# EAGLE design openSX70-FPC-breakout (EAGLE 8.5.1)
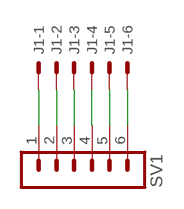
[diagram p0: schematic, sheet 1]

## Parts
J1  XF2L-0625-1  [XF2L-0625-1]
SV1  MA06-1  [MA06-1]

## Nets
GND: J1.1 SV1.1
N$2: J1.2 SV1.2
N$3: J1.3 SV1.3
N$4: J1.4 SV1.4
N$5: J1.5 SV1.5
N$6: J1.6 SV1.6

## Library data of the parts
J1 = con-omron:XF2*-06?: OMRON FPC Connector Source : http://www.omron.com/ecb/products/pdf/fpc.pdf; MF: OMRON COMPONENTS USA; MPN: XF2L-0625-1; OC_FARNELL: 1536105; OC_NEWARK: 29C7842
SV1 = con-lstb:MA06-1: PIN HEADER; OC_FARNELL: unknown; OC_NEWARK: unknown

## Net classes
0 default: width 0.152 mm, drill 0.33 mm, clearance 0.152 mm

## Board
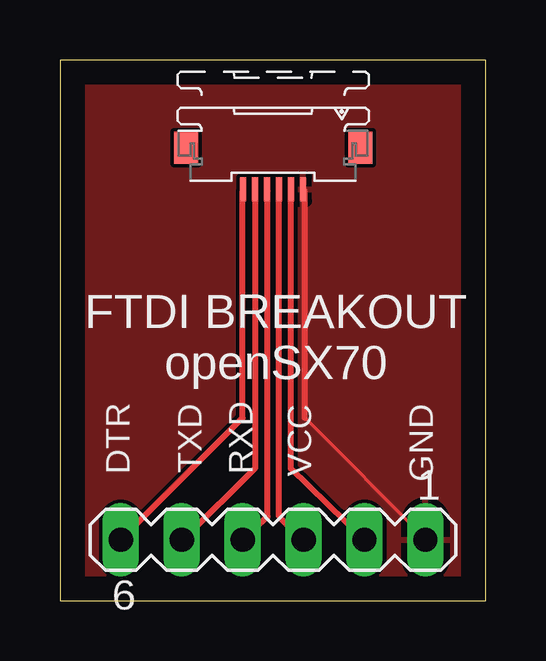
[diagram p1: board, top side]
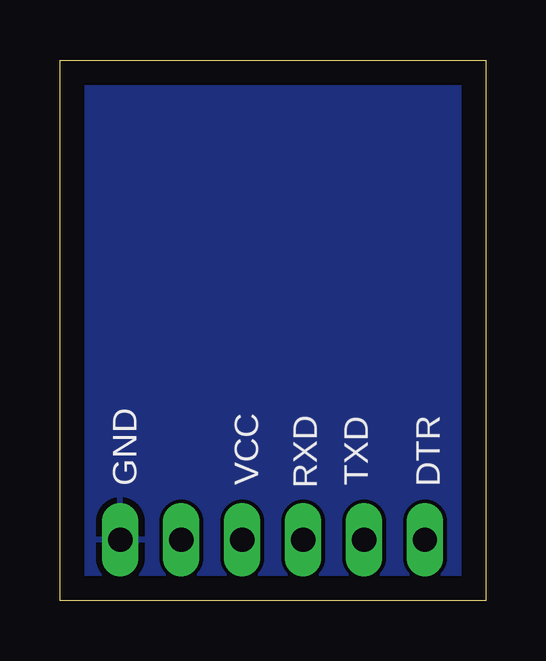
[diagram p2: board, bottom side, seen from below]

Size 17.76 x 22.53 mm. Coordinates in mm from the lower left corner, seen from the top.
Outline: 0,0 17.76,0 17.76,22.53 0,22.53 0,0
Copper layers (1*16): Top 0.035mm / dielectric 1.5mm / Bottom 0.035mm
Design rules "default": minimum track width 6mil, minimum drill 0.35mm, track to track 6mil, track to pad 6mil, pad to pad 6mil, via to via 6mil, smd to smd 6mil, copper to edge 40mil, drill to drill 6mil, minimum pad ring 10mil, minimum via ring 8mil, stop-mask expansion 4mil, vias tented up to drill 0mil, thermal gap 10mil

### Footprints (pad centres in the part's own frame; a part is rotated, then mirrored left to right if it is on the bottom)
XF2L-0625-1 = smd 1 x 0.25: 1 1.905,1.25; 2 1.905,0.75; 3 1.905,0.25; 4 1.905,-0.25; 5 1.905,-0.75; 6 1.905,-1.25 | smd 1.34 x 1: M1 0.18,3.638; M2 0.18,-3.638
MA06-1 = drill 1.016 long: 1 -6.35,0; 2 -3.81,0; 3 -1.27,0; 4 1.27,0; 5 3.81,0; 6 6.35,0

### Placement (x,y rotation side)
J1  8.89,19.05 270 top
SV1  8.89,2.54 180 top

### Tracks (layer width: path | path; a pad name or v marks a point on that pad's centre or on a via)
GND
  Top 0.152: 10.21,7.62 15.24,2.59 SV1.1 | 10.21,17.07 J1.1
  Top 0.254: 10.21,7.62 10.21,17.07
  pour Top: 0.05,22.55 17.98,22.48 18,0 0,0
  pour Bottom: 0,22 17,22 17,0 0,0
N$2
  Top 0.152: 9.63,17.09 J1.2
  Top 0.254: 9.63,17.09 9.63,5.51 SV1.2
N$3
  Top 0.152: 9.14,17.07 J1.3 | 10.06,2.59 SV1.3
  Top 0.254: 9.14,17.07 9.14,3.5 10.06,2.59
N$4
  Top 0.152: 8.66,17.07 J1.4 | 7.62,2.59 SV1.4
  Top 0.254: 8.66,17.07 8.66,3.5 7.62,2.59
N$5
  Top 0.152: 8.15,17.12 J1.5 | 5.18,2.59 SV1.5
  Top 0.254: 8.15,17.12 8.15,5.54 5.18,2.59
N$6
  Top 0.152: 7.62,17.07 J1.6
  Top 0.254: 7.62,17.07 7.62,7.62 SV1.6

### Text on the board
tPlace: FTDI BREAKOUT / openSX70 | DTR | TXD | RXD | VCC | GND
bPlace: DTR | TXD | RXD | VCC | GND